# Altium schematic sheet Sheet5.SchDoc: Наименование
size 420 x 297 mm; ApprovedBy: Vasil; CheckedBy: Vasil; Author: Vasil; CompanyName: Vasil; DrawnBy: n.a.; Engineer: Vasil; SheetNumber: 5; SheetTotal: 5; PageSetup: Record=PageOptions|CenterHorizontal=True|CenterVertical=True|PrintScale=0.94|XCorrection=1.00|YCorrection=1.00|PrintKind=1|BorderSize=5000000|LeftOffset=0|BottomOffset=0|Orientation=1|PaperLength=1000|PaperWidth=1000|Scale=100|PaperSource=7|PrintQuality=-4|MediaType=1|DitherType=10|PaperKind=A4|PrintScaleMode=1; DecimalNumber: 000.00006.001.VG; HeadOfSector: n.a.; MainDevice: HW; Name: CNC_interfaces_board; DocumentName: Sheet1.SCHDOC
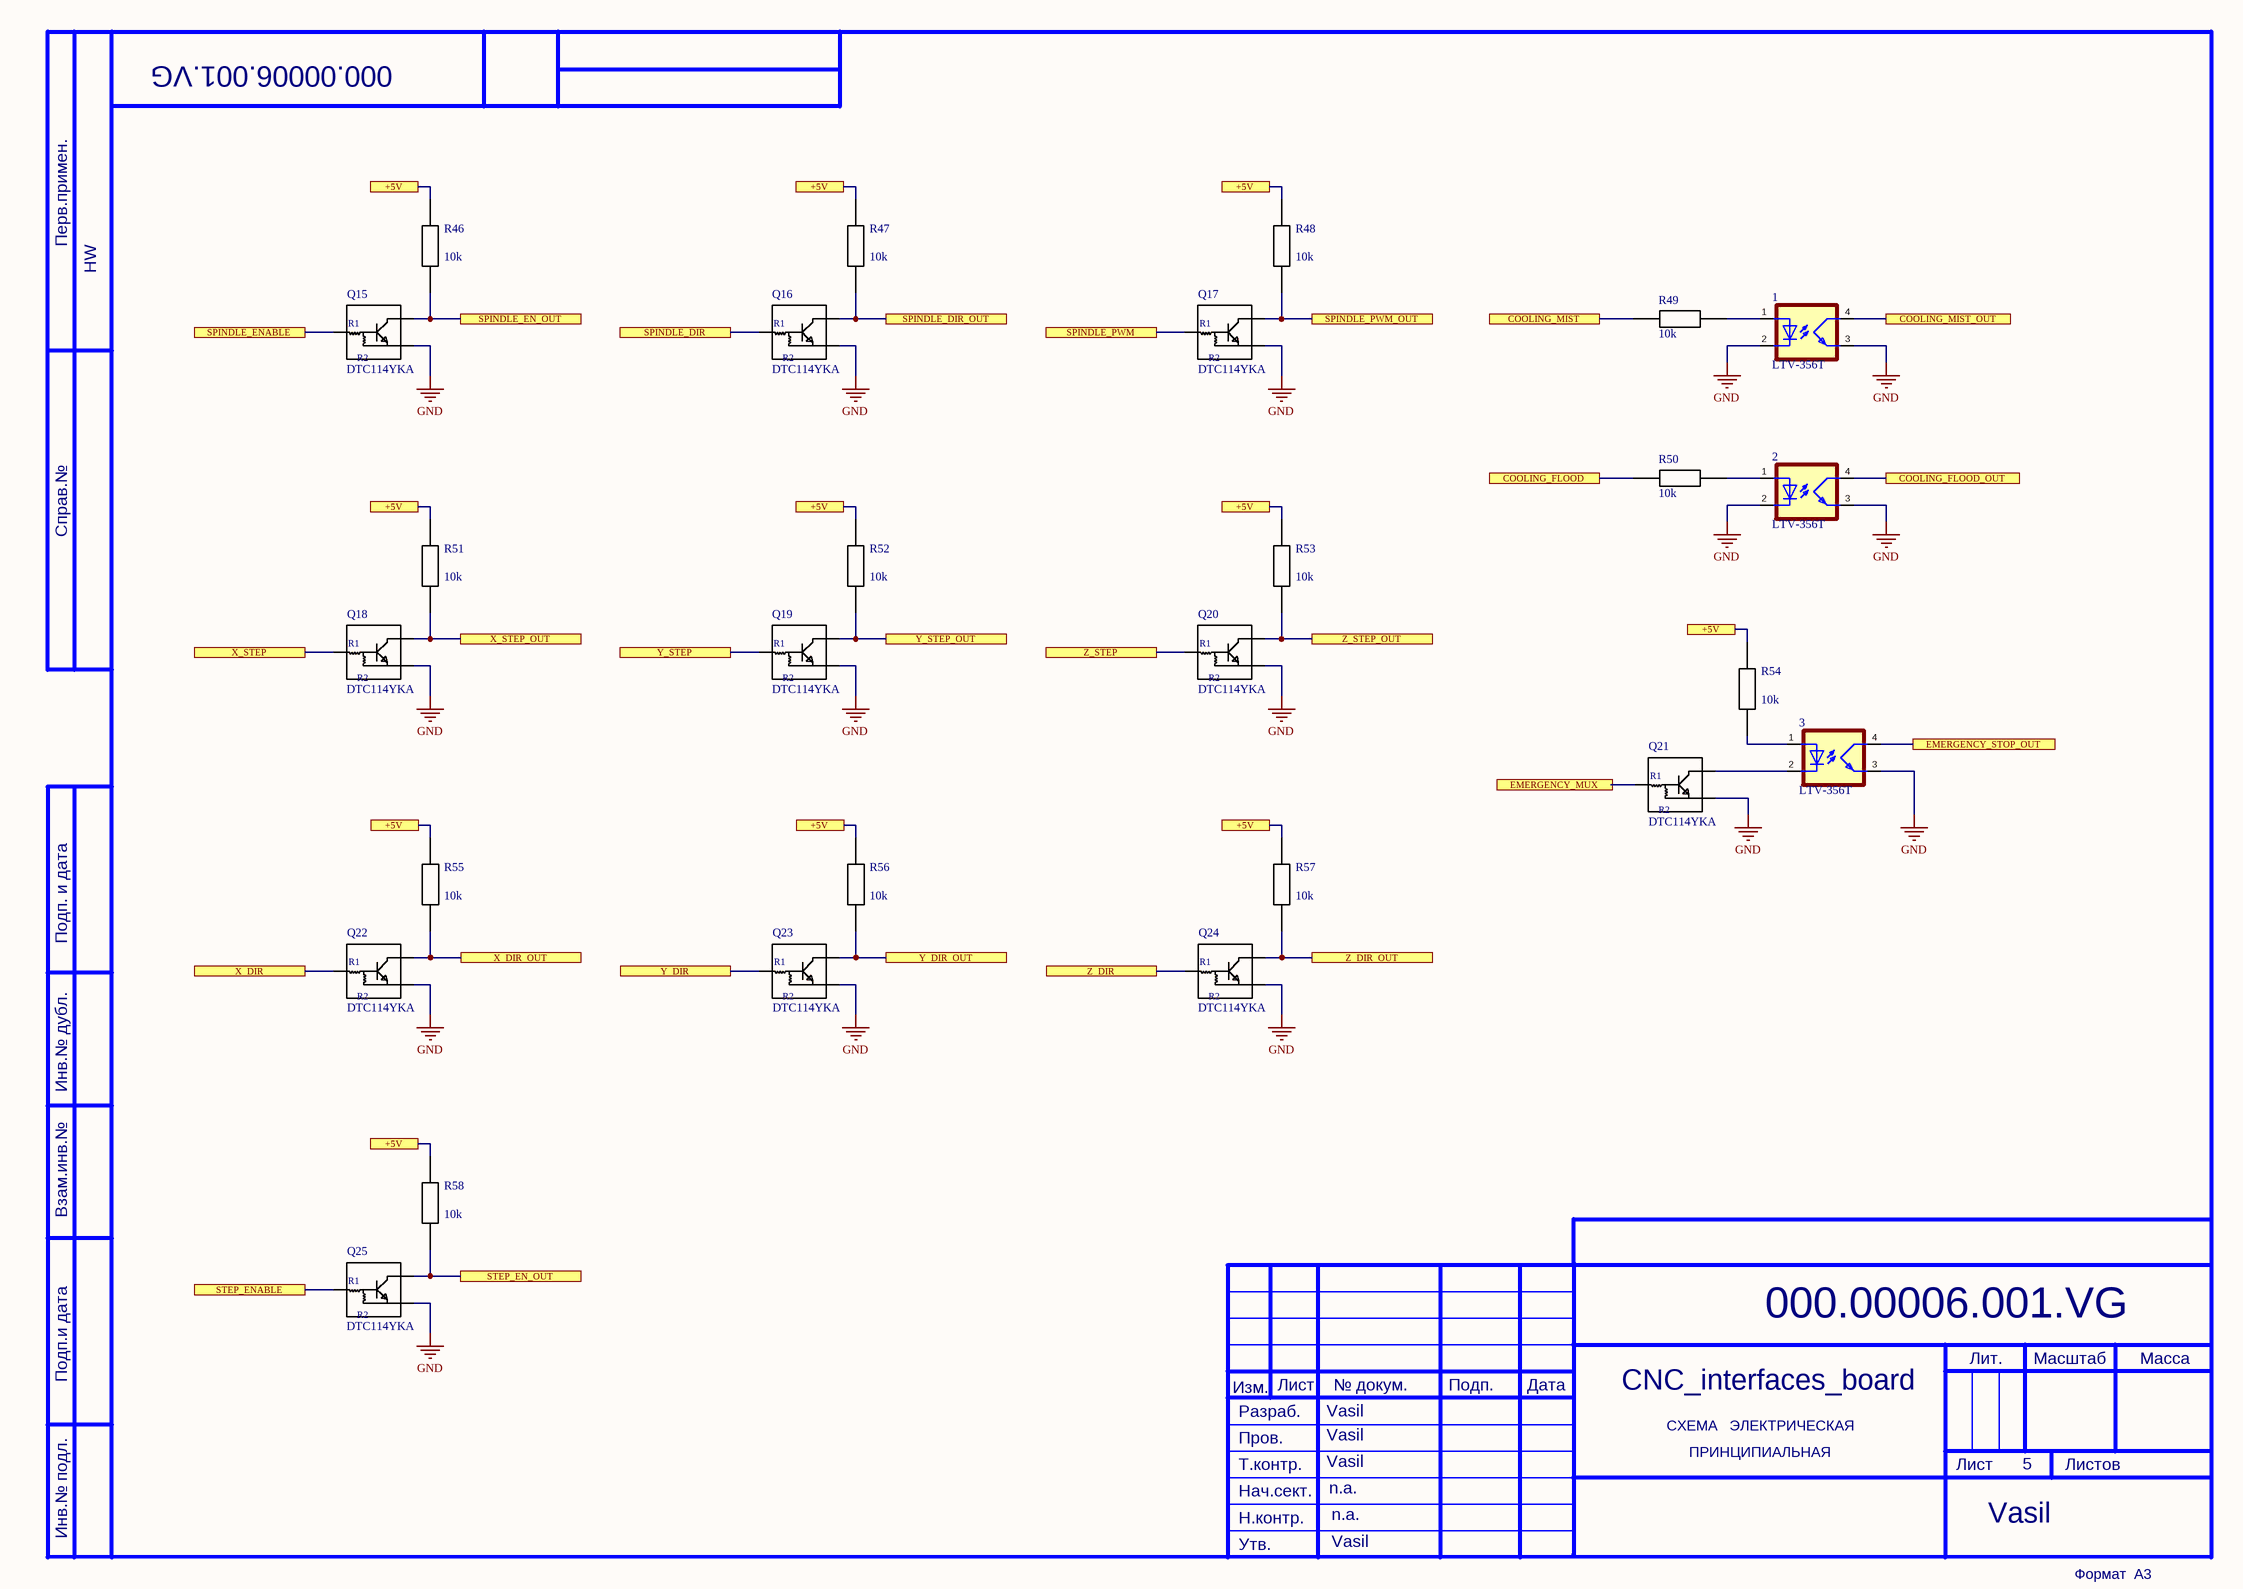
[diagram p0: Sheet5.SchDoc]

## Parts
1  LTV-356T  [MINI-FLAT-4]
2  LTV-356T  [MINI-FLAT-4]
3  LTV-356T  [MINI-FLAT-4]
Q15  DTC114YKA  [SOT-346 (SC59) Black]
Q16  DTC114YKA  [SOT-346 (SC59) Black]
Q17  DTC114YKA  [SOT-346 (SC59) Black]
Q18  DTC114YKA  [SOT-346 (SC59) Black]
Q19  DTC114YKA  [SOT-346 (SC59) Black]
Q20  DTC114YKA  [SOT-346 (SC59) Black]
Q21  DTC114YKA  [SOT-346 (SC59) Black]
Q22  DTC114YKA  [SOT-346 (SC59) Black]
Q23  DTC114YKA  [SOT-346 (SC59) Black]
Q24  DTC114YKA  [SOT-346 (SC59) Black]
Q25  DTC114YKA  [SOT-346 (SC59) Black]
R46  10k  [SMD 0805]
R47  10k  [SMD 0805]
R48  10k  [SMD 0805]
R49  10k  [SMD 0805]
R50  10k  [SMD 0805]
R51  10k  [SMD 0805]
R52  10k  [SMD 0805]
R53  10k  [SMD 0805]
R54  10k  [SMD 0805]
R55  10k  [SMD 0805]
R56  10k  [SMD 0805]
R57  10k  [SMD 0805]
R58  10k  [SMD 0805]

## Ports
+5V, COOLING_FLOOD, COOLING_FLOOD_OUT, COOLING_MIST, COOLING_MIST_OUT, EMERGENCY_MUX, EMERGENCY_STOP_OUT, SPINDLE_DIR, SPINDLE_DIR_OUT, SPINDLE_EN_OUT, SPINDLE_ENABLE, SPINDLE_PWM, SPINDLE_PWM_OUT, STEP_EN_OUT, STEP_ENABLE, X_DIR, X_DIR_OUT, X_STEP, X_STEP_OUT, Y_DIR, Y_DIR_OUT, Y_STEP, Y_STEP_OUT, Z_DIR, Z_DIR_OUT, Z_STEP, Z_STEP_OUT

## Nets
GND: 1.2(C) 1.3(EMIT) 2.2(C) 2.3(EMIT) 3.3(EMIT) Q15.2 Q16.2 Q17.2 Q18.2 Q19.2 Q20.2 Q21.2 Q22.2 Q23.2 Q24.2 Q25.2
+5V: R46.1 R47.1 R48.1 R51.1 R52.1 R53.1 R54.1 R55.1 R56.1 R57.1 R58.1 ; port +5V
COOLING_FLOOD: R50.1 ; port COOLING_FLOOD
COOLING_FLOOD_OUT: 2.4(COL) ; port COOLING_FLOOD_OUT
COOLING_MIST: R49.1 ; port COOLING_MIST
COOLING_MIST_OUT: 1.4(COL) ; port COOLING_MIST_OUT
EMERGENCY_MUX: Q21.1 ; port EMERGENCY_MUX
EMERGENCY_STOP_OUT: 3.4(COL) ; port EMERGENCY_STOP_OUT
SPINDLE_DIR: Q16.1 ; port SPINDLE_DIR
SPINDLE_DIR_OUT: Q16.3 R47.2 ; port SPINDLE_DIR_OUT
SPINDLE_EN_OUT: Q15.3 R46.2 ; port SPINDLE_EN_OUT
SPINDLE_ENABLE: Q15.1 ; port SPINDLE_ENABLE
SPINDLE_PWM: Q17.1 ; port SPINDLE_PWM
SPINDLE_PWM_OUT: Q17.3 R48.2 ; port SPINDLE_PWM_OUT
STEP_EN_OUT: Q25.3 R58.2 ; port STEP_EN_OUT
STEP_ENABLE: Q25.1 ; port STEP_ENABLE
X_DIR: Q22.1 ; port X_DIR
X_DIR_OUT: Q22.3 R55.2 ; port X_DIR_OUT
X_STEP: Q18.1 ; port X_STEP
X_STEP_OUT: Q18.3 R51.2 ; port X_STEP_OUT
Y_DIR: Q23.1 ; port Y_DIR
Y_DIR_OUT: Q23.3 R56.2 ; port Y_DIR_OUT
Y_STEP: Q19.1 ; port Y_STEP
Y_STEP_OUT: Q19.3 R52.2 ; port Y_STEP_OUT
Z_DIR: Q24.1 ; port Z_DIR
Z_DIR_OUT: Q24.3 R57.2 ; port Z_DIR_OUT
Z_STEP: Q20.1 ; port Z_STEP
Z_STEP_OUT: Q20.3 R53.2 ; port Z_STEP_OUT
Net1_1: 1.1(A) R49.2
Net2_1: 2.1(A) R50.2
Net3_1: 3.1(A) R54.2
Net3_2: 3.2(C) Q21.3

## Notes on the sheet
- Перв.примен.
- Справ.№
- Подп. и дата
- Инв.№ дубл.
- Взам.инв.№
- Подп.и дата
- Разраб.
- Изм.
- Лист
- № докум.
- Подп.
- Дата
- Лит.
- Масштаб
- Масса
- Т.контр.
- Пров.
- СХЕМА   ЭЛЕКТРИЧЕСКАЯ
- ПРИНЦИПИАЛЬНАЯ
- Листов
- Инв.№ подл.
- Утв.
- Н.контр.
- Нач.сект.
- Формат  A3
- (in symbol DTC114YKA) R1; R2

## Library data of the parts
1-3 = LTV-356T: Optoisolator Transistor Output 3750Vrms 1 Channel 4-SOP; MF: Lite-On Inc.; Package: SOP-4 Lite-On Inc.; Availability: Unavailable; Value: *; MP: LTV-356T; Price: None; SnapEDA_Link: https://www.snapeda.com/parts/LTV-356T/Lite-On%20Inc./view-part/448527/?ref=snap
Q15-Q25 = DTC114YKA: NPN Digital 50V 100mA 200mW  R1=10kOm R2=47kOm; Manufacturer: ROHM Semiconductor; HalpURL: https://store.comet.bg/Catalogue/Product/23715/; Case: SOT-346 (SC59); Model: DTC114YKA
R46-R58 = Resistor_1: RES; HelpURL: https://store.comet.bg/Catalogue/RES/Resistors/#eyJpcHAiOiIxMDAiLCJtIjoiIn0%3D; Value: 10k